# Altium project CANOPi_BaseBoard.PrjPcb (part 2 of 3)

## Sheet CANOPi_Baseboard_PWR.SchDoc
size A3; DocumentNumber: 1; SheetNumber: 1; SheetTotal: 5; CopyrightYear: 2021
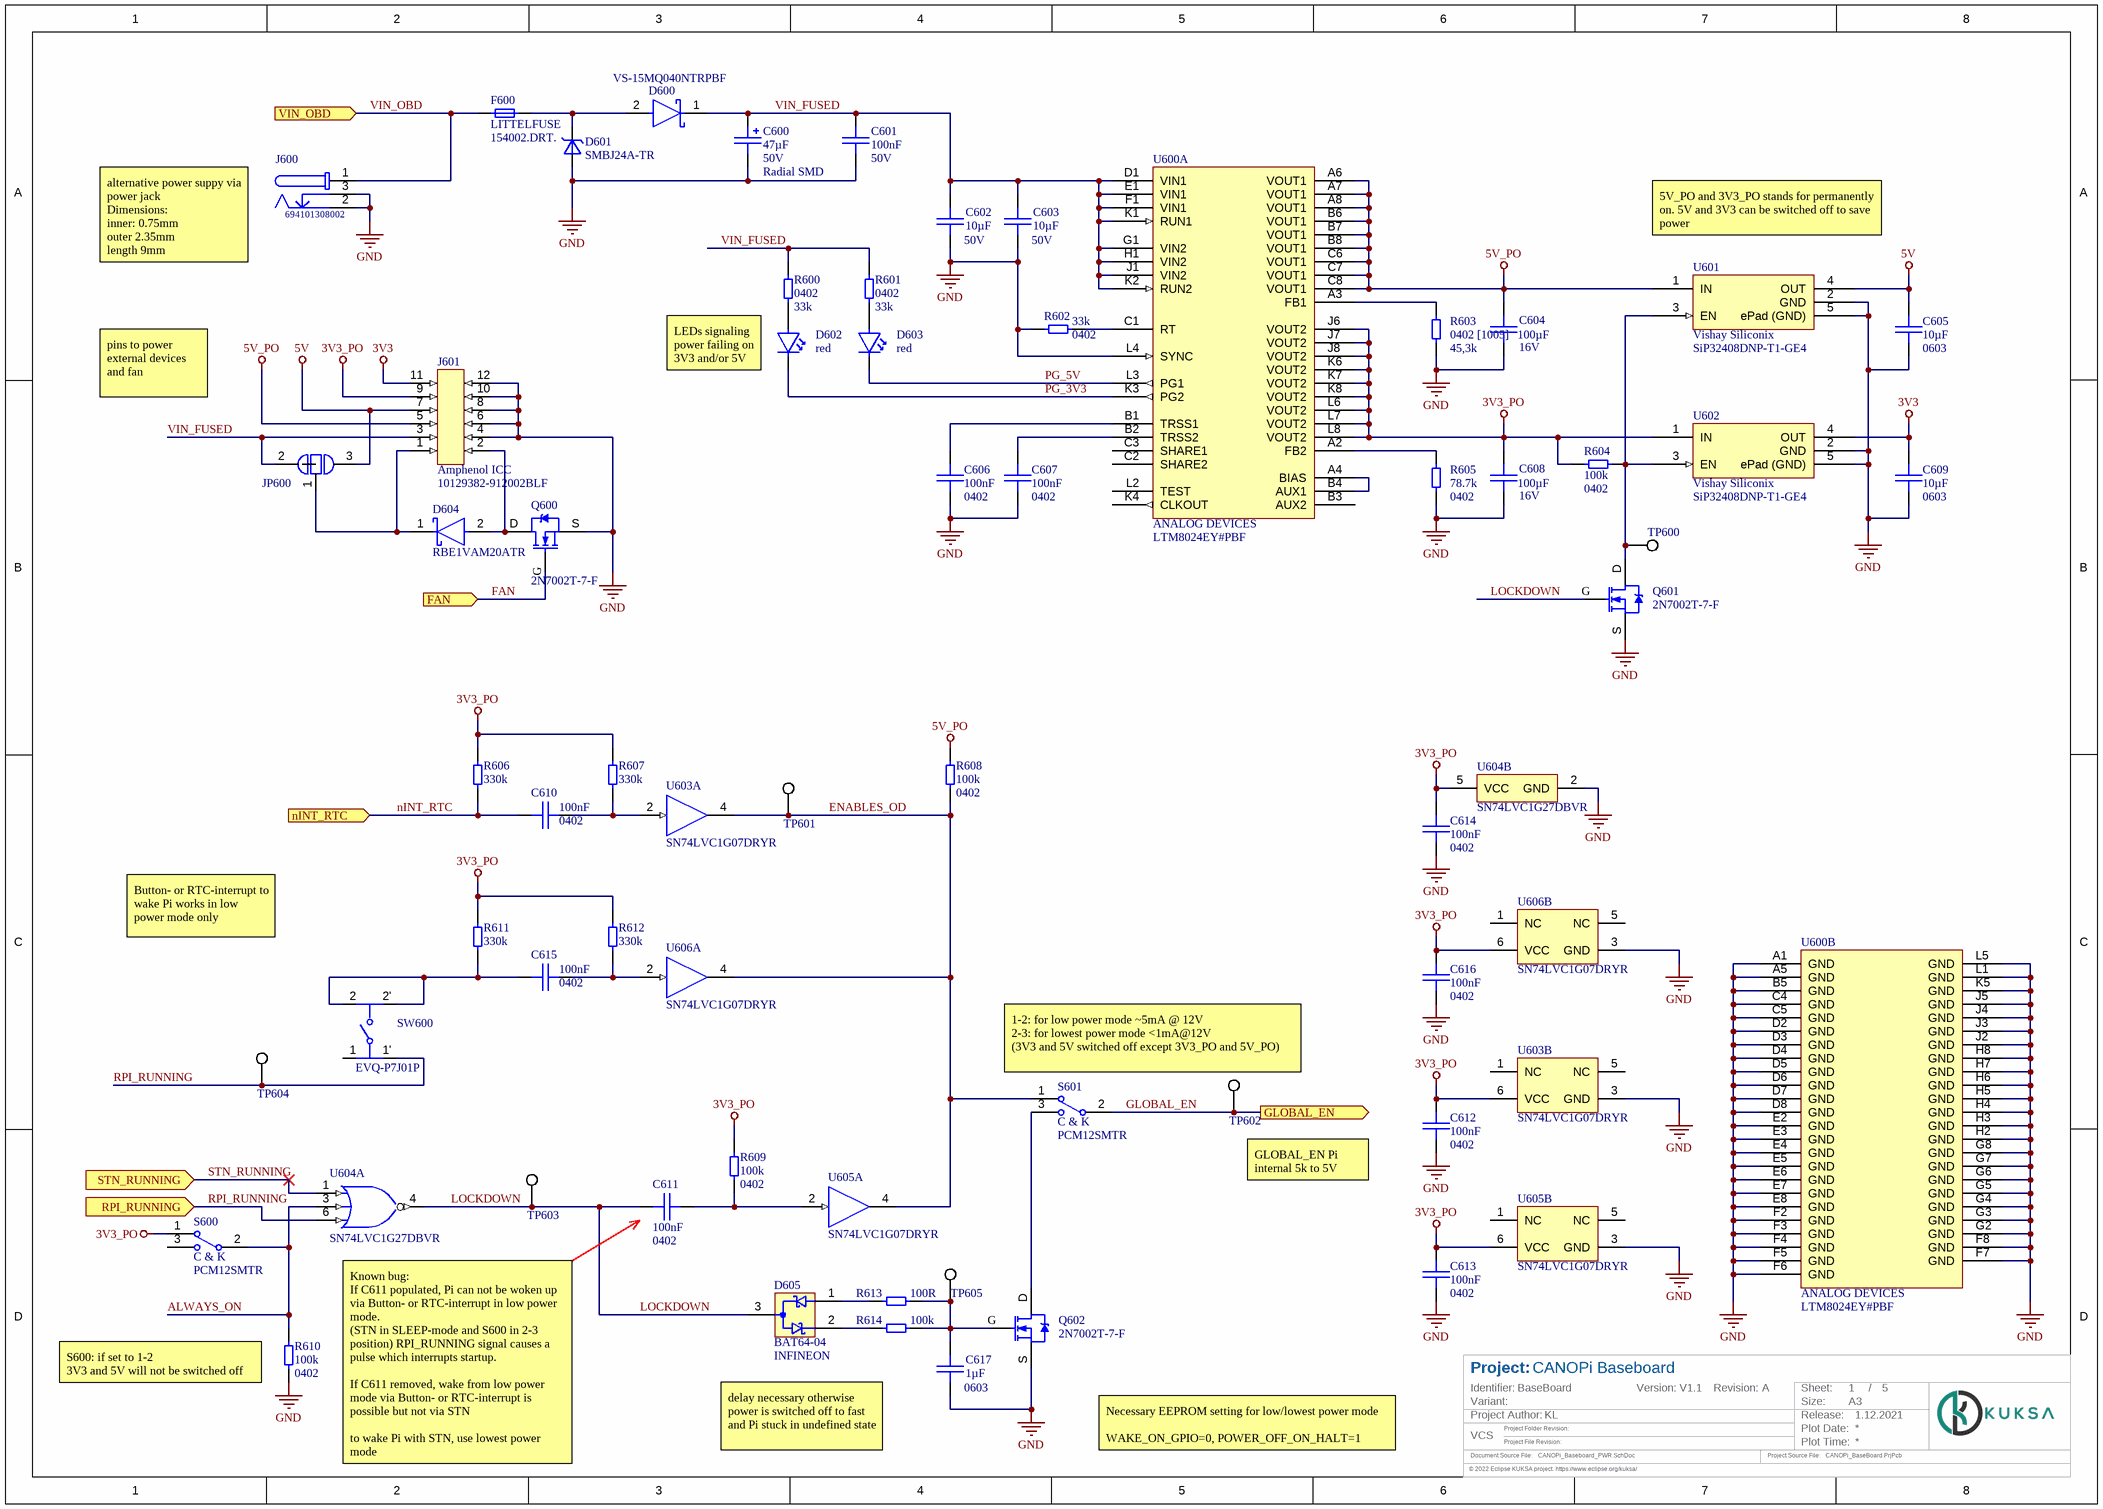
[diagram p2: CANOPi_Baseboard_PWR.SchDoc]

### Parts
C600  Capacitance: 47µF  Voltage Rating: 50V  Case: Radial SMD  [WCAP-ASLI_6.3x7.7]  (hidden comment: CAP2625 47u -20% +20% 50V)
C601  Capacitance: 100nF  Voltage Rating: 50V  [CAP 0603 [1608 Metric] X080 N]  (hidden comment: CAP 0603 100n -10% +10% 50V X7R)
C602  Capacitance: 10µF  Voltage Rating: 50V  [CAP 1206 [3216 Metric] X160 N]  (hidden comment: CAP 1206 10u -10% +10% 50V X5R)
C603  Capacitance: 10µF  Voltage Rating: 50V  [CAP 1206 [3216 Metric] X160 N]  (hidden comment: CAP 1206 10u -10% +10% 50V X5R)
C604  Voltage Rating: 16V  Capacitance: 100µF  [CAP 1210 [3225 Metric] X250 N]  (hidden comment: CAP 1210 100µF +/-20% 16V X5R)
C605  Capacitance: 10µF  Case: 0603  [CAP 0603 [1608 Metric] X080 N]  (hidden comment: CAP 0603 10µF -20% +20% 6.3V X5R)
C606  Capacitance: 100nF  Case: 0402  [CAP 0402 [1005 Metric] X050 N]  (hidden comment: CAP 0402 100n -10% +10% 6.3V X7R)
C607  Capacitance: 100nF  Case: 0402  [CAP 0402 [1005 Metric] X050 N]  (hidden comment: CAP 0402 100n -10% +10% 6.3V X7R)
C608  Voltage Rating: 16V  Capacitance: 100µF  [CAP 1210 [3225 Metric] X250 N]  (hidden comment: CAP 1210 100µF +/-20% 16V X5R)
C609  Capacitance: 10µF  Case: 0603  [CAP 0603 [1608 Metric] X080 N]  (hidden comment: CAP 0603 10µF -20% +20% 6.3V X5R)
C610  Capacitance: 100nF  Case: 0402  [CAP 0402 [1005 Metric] X050 N]  (hidden comment: CAP 0402 100n -10% +10% 6.3V X7R)
C611  Capacitance: 100nF  Case: 0402  [CAP 0402 [1005 Metric] X050 N]  (hidden comment: CAP 0402 100n -10% +10% 6.3V X7R)
C612  Capacitance: 100nF  Case: 0402  [CAP 0402 [1005 Metric] X050 N]  (hidden comment: CAP 0402 100n -10% +10% 6.3V X7R)
C613  Capacitance: 100nF  Case: 0402  [CAP 0402 [1005 Metric] X050 N]  (hidden comment: CAP 0402 100n -10% +10% 6.3V X7R)
C614  Capacitance: 100nF  Case: 0402  [CAP 0402 [1005 Metric] X050 N]  (hidden comment: CAP 0402 100n -10% +10% 6.3V X7R)
C615  Capacitance: 100nF  Case: 0402  [CAP 0402 [1005 Metric] X050 N]  (hidden comment: CAP 0402 100n -10% +10% 6.3V X7R)
C616  Capacitance: 100nF  Case: 0402  [CAP 0402 [1005 Metric] X050 N]  (hidden comment: CAP 0402 100n -10% +10% 6.3V X7R)
C617  Capacitance: 1µF  Case: 0603  [CAP 0603 [1608 Metric] X080 N]  (hidden comment: CAP 0603 1u -10% +10% 10V X7R)
D600  VS-15MQ040NTRPBF  [FP-95400-MFG]
D601  Manufacturer Part Number: SMBJ24A-TR  [DO-214AA (SMB) DIOC5436X26N]  (hidden comment: STMICROELECTRONICS - SMBJ24A-TR)
D602  Colour LED1: red  [WUERTH ELEKTRONIK - WL-SMSW]  (hidden comment: WUERTH ELEKTRONIK - 155124RS73200)
D603  Colour LED1: red  [WUERTH ELEKTRONIK - WL-SMSW]  (hidden comment: WUERTH ELEKTRONIK - 155124RS73200)
D604  RBE1VAM20ATR  [FP-TUMD2M-MFG]
D605  Manufacturer Part Number: BAT64-04  Manufacturer: INFINEON  [INFINEON - BAT64-04]  (hidden comment: INFINEON - BAT64-04)
F600  Manufacturer: LITTELFUSE  Manufacturer Part Number: 154002.DRT.  [LITTELFUSE - 154 OMNI-BLOK]  (hidden comment: LITTELFUSE - 154002.DRT.)
J600  694101308002  [694101308002]
J601  Manufacturer: Amphenol ICC  Manufacturer Part Number: 10129382-912002BLF  [AMPHENOL - 10129382-Footprint-1]  (hidden comment: AMPHENOL - 10129382)
JP600  Solder Jumper Triple 0402 with Assembly between 1 and 2  [Solder Jumper Triple 0402 with Assembly between 1 and 2]  (value not drawn)
Q600  Manufacturer Part Number: 2N7002T-7-F  [DIODES INCORPORATED - SOT523]  (hidden comment: DIODES INCORPORATED - 2N7002T)
Q601  Manufacturer Part Number: 2N7002T-7-F  [DIODES INCORPORATED - SOT523]  (hidden comment: DIODES INCORPORATED - 2N7002T)
Q602  Manufacturer Part Number: 2N7002T-7-F  [DIODES INCORPORATED - SOT523]  (hidden comment: DIODES INCORPORATED - 2N7002T)
R600  Case: 0402  Resistance: 33k  [RES 0402 [1005 Metric]_N]  (hidden comment: RES 0402 33K 1% 0W0625)
R601  Case: 0402  Resistance: 33k  [RES 0402 [1005 Metric]_N]  (hidden comment: RES 0402 33K 1% 0W0625)
R602  Case: 0402  Resistance: 33k  [RES 0402 [1005 Metric]_N]  (hidden comment: RES 0402 33K 1% 0W0625)
R603  Case: 0402 [1005]  Resistance: 45,3k  [RES 0402 [1005 Metric]_N]  (hidden comment: RES 0402 45K3 1% 0W0625)
R604  Resistance: 100k  Case: 0402  [RES 0402 [1005 Metric]_N]  (hidden comment: RES 0402 100K 1% 0W0625)
R605  Case: 0402  Resistance: 78.7k  [RES 0402 [1005 Metric]_N]  (hidden comment: RES 0402 78K7 1% 0W0625)
R606  Resistance: 330k  [RES 0402 [1005 Metric]_N]  (hidden comment: RES 0402 330K 1% 0W0625)
R607  Resistance: 330k  [RES 0402 [1005 Metric]_N]  (hidden comment: RES 0402 330K 1% 0W0625)
R608  Resistance: 100k  Case: 0402  [RES 0402 [1005 Metric]_N]  (hidden comment: RES 0402 100K 1% 0W0625)
R609  Resistance: 100k  Case: 0402  [RES 0402 [1005 Metric]_N]  (hidden comment: RES 0402 100K 1% 0W0625)
R610  Resistance: 100k  Case: 0402  [RES 0402 [1005 Metric]_N]  (hidden comment: RES 0402 100K 1% 0W0625)
R611  Resistance: 330k  [RES 0402 [1005 Metric]_N]  (hidden comment: RES 0402 330K 1% 0W0625)
R612  Resistance: 330k  [RES 0402 [1005 Metric]_N]  (hidden comment: RES 0402 330K 1% 0W0625)
R613  Resistance: 100R  [RES 0402 [1005 Metric]_N]  (hidden comment: RES 0402 100R 1% 63mW)
R614  Resistance: 100k  [RES 0402 [1005 Metric]_N]  (hidden comment: RES 0402 100K 1% 0W0625)
S600  Manufacturer: C & K  [PCM12SMTR]  (hidden comment: C & K - PCM12SMTR)
S601  Manufacturer: C & K  [PCM12SMTR]  (hidden comment: C & K - PCM12SMTR)
SW600  EVQ-P7J01P  [FP-EVQ-P7J01P-MFG]
TP600  Testpad, 0.8mm x 0.8mm, round  [Testpad, 0.8mm x 0.8mm, round]  (value not drawn)  (no BOM)
TP601  Testpad, 0.8mm x 0.8mm, round  [Testpad, 0.8mm x 0.8mm, round]  (value not drawn)  (no BOM)
TP602  Testpad, 0.8mm x 0.8mm, round  [Testpad, 0.8mm x 0.8mm, round]  (value not drawn)  (no BOM)
TP603  Testpad, 0.8mm x 0.8mm, round  [Testpad, 0.8mm x 0.8mm, round]  (value not drawn)  (no BOM)
TP604  Testpad, 0.8mm x 0.8mm, round  [Testpad, 0.8mm x 0.8mm, round]  (value not drawn)  (no BOM)
TP605  Testpad, 0.8mm x 0.8mm, round  [Testpad, 0.8mm x 0.8mm, round]  (value not drawn)  (no BOM)
U600  Manufacturer: ANALOG DEVICES  Manufacturer Part Number: LTM8024EY#PBF  [ANALOG DEVICES - LTM8024]  (hidden comment: ANALOG DEVICES - LTM8024EY#PBF)  (parts A,B of 2)
U601  Manufacturer: Vishay Siliconix  Manufacturer Part Number: SiP32408DNP-T1-GE4  [DFN130P160X60-4N]  (hidden comment: VISHAY - SIP32408)
U602  Manufacturer: Vishay Siliconix  Manufacturer Part Number: SiP32408DNP-T1-GE4  [DFN130P160X60-4N]  (hidden comment: VISHAY - SIP32408)
U603  SN74LVC1G07DRYR  [DRY0006A_V]  (parts A,B of 2)
U604  SN74LVC1G27DBVR  [DBV0006A_N]  (parts A,B of 2)
U605  SN74LVC1G07DRYR  [DRY0006A_V]  (parts A,B of 2)
U606  SN74LVC1G07DRYR  [DRY0006A_V]  (parts A,B of 2)

### Ports
FAN (in), GLOBAL_EN (out), nINT_RTC (in), RPI_RUNNING (in), STN_RUNNING (in), VIN_OBD (in)

### Nets
3V3: C609.1 J601.11 U602.4(OUT)
3V3_PO: C608.2 C612.1 C613.1 C614.1 C616.1 J601.9 R604.2 R606.2 R607.2 R609.2 R611.2 R612.2 S600.1 U600.J6(VOUT2) U600.J7(VOUT2) U600.J8(VOUT2) U600.K6(VOUT2) U600.K7(VOUT2) U600.K8(VOUT2) U600.L6(VOUT2) U600.L7(VOUT2) U600.L8(VOUT2) U602.1(IN) U603.6(VCC) U604.5(VCC) U605.6(VCC) U606.6(VCC)
5V: C605.1 J601.7 JP600.3 U601.4(OUT)
5V_PO: C604.2 J601.5 R608.2 U600.A6(VOUT1) U600.A7(VOUT1) U600.A8(VOUT1) U600.B6(VOUT1) U600.B7(VOUT1) U600.B8(VOUT1) U600.C6(VOUT1) U600.C7(VOUT1) U600.C8(VOUT1) U601.1(IN)
GND: C600.2 C601.1 C602.1 C603.1 C604.1 C605.2 C606.2 C607.2 C608.1 C609.2 C612.2 C613.2 C614.2 C616.2 C617.2 D601.A J600.2 J600.3 J601.4 J601.6 J601.8 J601.10 J601.12 Q600.S Q601.S Q602.S R602.2 R603.1 R605.1 R610.1 U600.A1(GND) U600.A5(GND) U600.B5(GND) U600.C4(GND) U600.C5(GND) U600.D2(GND) U600.D3(GND) U600.D4(GND) U600.D5(GND) U600.D6(GND) U600.D7(GND) U600.D8(GND) U600.E2(GND) U600.E3(GND) U600.E4(GND) U600.E5(GND) U600.E6(GND) U600.E7(GND) U600.E8(GND) U600.F2(GND) U600.F3(GND) U600.F4(GND) U600.F5(GND) U600.F6(GND) U600.F7(GND) U600.F8(GND) U600.G2(GND) U600.G3(GND) U600.G4(GND) U600.G5(GND) U600.G6(GND) U600.G7(GND) U600.G8(GND) U600.H2(GND) U600.H3(GND) U600.H4(GND) U600.H5(GND) U600.H6(GND) U600.H7(GND) U600.H8(GND) U600.J2(GND) U600.J3(GND) U600.J4(GND) U600.J5(GND) U600.K5(GND) U600.L1(GND) U600.L4(SYNC) U600.L5(GND) U601.2(GND) U601.5(ePad_(GND)) U602.2(GND) U602.5(ePad_(GND)) U603.3(GND) U604.2(GND) U605.3(GND) U606.3(GND)
ALWAYS_ON: R610.2 S600.2 U604.3(B)
ENABLES_OD: R608.1 S601.1 TP601.1 U603.4(Y) U605.4(Y) U606.4(Y)
FAN: Q600.G ; port FAN
GLOBAL_EN: S601.2 TP602.1 ; port GLOBAL_EN
LOCKDOWN: C611.1 D605.3 Q601.G TP603.1 U604.4(Y)
nINT_RTC: C610.2 R606.1 ; port nINT_RTC
PG_3V3: D602.C U600.K3(PG2)
PG_5V: D603.C U600.L3(PG1)
RPI_RUNNING: SW600.1' TP604.1 U604.6(C) ; port RPI_RUNNING
STN_RUNNING: U604.1(A) ; port STN_RUNNING
VIN_FUSED: C600.1 C601.2 C602.2 C603.2 D600.1(C) J601.3 JP600.2 R600.1 R601.1 U600.D1(VIN1) U600.E1(VIN1) U600.F1(VIN1) U600.G1(VIN2) U600.H1(VIN2) U600.J1(VIN2) U600.K1(RUN1) U600.K2(RUN2)
VIN_OBD: F600.1 J600.1 ; port VIN_OBD
NetC606_1: C606.1 U600.B1(TRSS1)
NetC607_1: C607.1 U600.B2(TRSS2)
NetC610_1: C610.1 R607.1 U603.2(A)
NetC611_2: C611.2 R609.1 U605.2(A)
NetC615_1: C615.1 R612.1 U606.2(A)
NetC615_2: C615.2 R611.1 SW600.2 SW600.2'
NetC617_1: C617.1 Q602.G R613.1 R614.1 TP605.1
NetD600_2: D600.2(A) D601.C F600.2
NetD602_A: D602.A R600.2
NetD603_A: D603.A R601.2
NetD604_1: D604.1(C) J601.1 JP600.1
NetD604_2: D604.2(A) J601.2 Q600.D
NetD605_1: D605.1 R613.2
NetD605_2: D605.2 R614.2
NetQ601_D: Q601.D R604.1 TP600.1 U601.3(EN) U602.3(EN)
NetQ602_D: Q602.D S601.3
NetR602_1: R602.1 U600.C1(RT)
NetR603_2: R603.2 U600.A3(FB1)
NetR605_2: R605.2 U600.A2(FB2)
NetU600_A4: U600.A4(BIAS) U600.B4(AUX1)

Not connected (* = marked no-connect by the designer): S600 3; SW600 1; U600 B3(AUX2) C2(SHARE2) C3(SHARE1) K4(CLKOUT) L2(TEST); U603 1(NC) 5(NC); U605 1(NC) 5(NC); U606 1(NC) 5(NC)

### Notes on the sheet
- 5V_PO and 3V3_PO stands for permanently on. 5V and 3V3 can be switched off to save power
- alternative power suppy via power jack
  Dimensions:
  inner: 0.75mm
  outer 2.35mm
  length 9mm
- LEDs signaling
  power failing on 3V3 and/or 5V rail
- pins to power external devices and fan
- Button- or RTC-interrupt to wake Pi works in low power mode only
- 1-2: for low power mode ~5mA @ 12V
  2-3: for lowest power mode <1mA@12V
  (3V3 and 5V switched off except 3V3_PO and 5V_PO)
- GLOBAL_EN Pi internal 5k to 5V
- (near R610) S600: if set to 1-2
  3V3 and 5V will not be switched off
- Project:
- Identifier:
- Version:
- Revision:
- Sheet:
- /
- Known bug:
  If C611 populated, Pi can not be woken up via Button- or RTC-interrupt in low power mode.
  (STN in SLEEP-mode and S600 in 2-3 position) RPI_RUNNING signal causes a pulse which interrupts startup.
  If C611 removed, wake from low power mode via Button- or RTC-interrupt is possible but not via STN
  to wake Pi with STN, use lowest power mode
- delay necessary otherwise power is switched off to fast and Pi stuck in undefined state
- Necessary EEPROM setting for low/lowest power mode
  WAKE_ON_GPIO=0, POWER_OFF_ON_HALT=1
- VCS
- Variant:
- Document Source File:
- Project Author:
- Project Folder Revision:
- Project File Revision:
- Project Source File:
- Plot Date:
- Size:
- Plot Time:
- Release:
- A3
- © 2022 Eclipse KUKSA project. https://www.eclipse.org/kuksa/
- Drawn by:
- © Robert Bosch GmbH         . All rights reserved, also regarding any disposal, exploitation, reproduction, editing, distribution, as well as in the event of applications for industrial property rights.

### Library data of the parts
C600 = CMP-04572-5: WCAP-ASLL Aluminium Electrolytic Capacitor (SMD Type): -55°C to 105°, Reflow Soldering, Low Impedance; Manufacturer: WUERTH ELEKTRONIK; Manufacturer Part Number: 865060645008; Assembly: yes; Capacitance Tolerance pos: 20%; Impedance: 0,68; Ripple Current max: 185mA; Leak Current: 23,5µA; Ripple Frequency: 100kHz; Value: 47µF; Capacitance Tolerance neg: -20%; ComponentLink1Description: Datasheet; ComponentLink1URL: http://katalog.we-online.de/pbs/datasheet/865060645008.pdf; Mounting Type: SMT; Operating Temperature max: 105°C; Operating Temperature min: -55°C
C601 = CMP-11004-1: SMD/SMT 0603 50V -10% +10% X7R - Multilayer Ceramic Capacitors MLCC; Manufacturer Part Number: 885012206095; Manufacturer: WUERTH ELEKTRONIK; Value: 100nF; Capacitance Tolerance pos: 10%; Assembly: yes; Operating Temperature max: 125°C; Mounting Type: SMT; Operating Temperature min: -55°C; Dielectric Type: X7R; Capacitance Tolerance neg: -10%; IPC Footprint Naming: CAPC1608X080; ComponentLink1Description: Datasheet; ComponentLink1URL: https://www.we-online.de/katalog/datasheet/885012206095.pdf; Case: 0603 [1608]
C602 C603 = CMP-05401-6: Multilayer Ceramic Capacitors MLCC - SMD/SMT 10uF 50Volts 10%; Manufacturer: MURATA; Manufacturer Part Number: GRT31CR61H106KE01; Assembly: yes; Value: 10µF; IPC Footprint Naming: CAPC3216X160; Mounting Type: SMT; Capacitance Tolerance neg: -10%; Operating Temperature max: 85°C; Operating Temperature min: -55°C; ComponentLink1Description: Datasheet; Case: 1206 [3216]; Dielectric Type: X5R; Capacitance Tolerance pos: 10%; ComponentLink1URL: https://psearch.en.murata.com/capacitor/product/GRT31CR61H106KE01%23.html
C604 C608 = CMP-10010-2: 100µF ±20% 16V Ceramic Capacitor X5R 1210 (3225 Metric); Manufacturer Part Number: EMK325ABJ107MM-T; Manufacturer: TAIYO YUDEN; Assembly: yes; Capacitance Tolerance neg: -20%; Dielectric Type: X5R; Operating Temperature min: -55°C; Capacitance Tolerance pos: 20%; ComponentLink1Description: Manufacturer Link; Mounting Type: SMT; Operating Temperature max: 85°C; Case: 1210 [3225]; ComponentLink1URL: https://www.yuden.co.jp/productdata/catalog/mlcc06_e.pdf; Value: 100µF
C605 C609 = CMP-06061-3: SMT 10µF ±20% 6,3 V Keramikkondensatoren X5R; Manufacturer Part Number: GRM188R60J106ME84; Manufacturer: MURATA; Voltage Rating: 6,3V; Assembly: yes; Operating Temperature max: 85°C; IPC Footprint Naming: CAPC1608X080; Mounting Type: SMT; Dielectric Type: X5R; Value: 10µF; ComponentLink1Description: Datasheet; Capacitance Tolerance pos: 20%; ComponentLink1URL: https://search.murata.co.jp/Ceramy/image/img/A01X/G101/ENG/GRM188R60J106ME84-01.pdf; Operating Temperature min: -55°C; Capacitance Tolerance neg: -20%
C606 C607 C610-C616 = CMP-04212-4: SMD/SMT 0402 6.3V -10% +10% X7R - Multilayer Ceramic Capacitors MLCC; Manufacturer: MURATA; Manufacturer Part Number: GRM155R70J104KA01#; Capacitance Tolerance pos: 10%; Value: 100nF; Assembly: yes; Operating Temperature min: -55°C; Voltage Rating: 6.3V; Operating Temperature max: 125°C; ComponentLink1URL: http://psearch.en.murata.com/capacitor/lineup/grm/; IPC Footprint Naming: CAPC1005X050; Capacitance Tolerance neg: -10%; ComponentLink1Description: Datasheet; Dielectric Type: X7R; Mounting Type: SMT
C617 = CMP-02997-5: SMD/SMT 0603 10V -10% +10% X7R - Multilayer Ceramic Capacitors MLCC; Manufacturer Part Number: GRM188R71A105KA61#; Manufacturer: MURATA; Capacitance Tolerance pos: 10%; Value: 1µF; Assembly: yes; IPC Footprint Naming: CAPC1608X080; Voltage Rating: 10V; Mounting Type: SMT; Operating Temperature max: 125°C; Operating Temperature min: -55°C; ComponentLink1Description: Datasheet; Capacitance Tolerance neg: -10%; ComponentLink1URL: http://psearch.en.murata.com/capacitor/lineup/grm/; Dielectric Type: X7R
D600 = CMP-02539-000025-1: DIODE SCHOTTKY 40V 1.5A SMA; Manufacturer: Vishay; Standoff Height: 0mm; Capacitance: 134pF; Peak Reverse Current: 0.5mA; Max Junction Temp: +150°C; Value: 134pF; Max Surge Forward Current: 140A; RoHS: TRUE; Lead Free: Yes; Octopart: https://octopart.com/vs-15mq040ntrpbf-vishay-44340959; Max Repetitive Reverse Voltage: 40V; Device Class L1: Discrete Semiconductors; ComponentLink2URL: http://www.vishay.com/docs/94141/vs-15mq040ntrpbf.pdf; Reverse Voltage: 40V; ComponentLink2Description: Datasheet; Forward Current: 1.5A; Temperature: -40°C to +150°C; Digikey Description: DIODE SCHOTTKY 40V 1.5A SMA; Height: 2.29mm; Category: Diode; Footprint Url: http://www.vishay.com/docs/95400/sma.pdf; Device Class L2: Diodes; Device Class L3: Schottky Diodes; Mouser Description: Schottky Diodes & Rectifiers 2.1 Amp 40 Volt; Manufacturer Part Number: VS-15MQ040NTRPBF; Automotive: No; Package: 95400; Temperature Range Low: -40°C; Temperature Range High: +150°C
D601 = CMP-06267-5: TVS DIODE unidirectional 24V DO214AA SMB; Breakdown Voltage: 28.1V; ESD Voltage Contact: 8kV; Assembly: yes; No. of Channels: 1; ESD Voltage Air: 15kV; ComponentLink1Description: Datasheet; Operating Temperature max: 150°C; Channel Type: unidirectional; Manufacturer: STMICROELECTRONICS; ComponentLink1URL: https://www.st.com/resource/en/datasheet/smbj.pdf; Operating Temperature min: -55°C; Mounting Type: SMT; Case: DO-214AA (SMB); Reverse Standoff Voltage: 24V
D602 D603 = CMP-11201-1: LED, RED, Right Angle SMD 3.2*1.0mm WL-SMSW SMT Mono-color Side view Waterclear; View Angle: 120°; Wavelength LED1: 470nm; Reverse Voltage LED1: 5V; Forward Voltage LED1: 2V; Luminous Intensity LED1: 150mcd; Forward Current LED1: 25mA; Assembly: yes; Case: 1305; Operating Temperature max: 85°C; ComponentLink1Description: Datahseet; Manufacturer: WUERTH ELEKTRONIK; Operating Temperature min: -40°C; ComponentLink1URL: https://katalog.we-online.de/led/datasheet/155124BS73200.pdf; Mounting Type: SMT; Manufacturer Part Number: 155124RS73200
D604 = CMP-08971-000009-1: DIODE SCHOTTKY 20V 1A TUMD2M; Manufacturer: Rohm; Max Repetitive Reverse Voltage: 30V; Peak Reverse Current: 200uA; Max Surge Forward Current: 3A; Max Junction Temp: +125°C; Category: Diode; Manufacturer Part Number: RBE1VAM20ATR; Automotive: No; Height: 0.8mm; ComponentLink2Description: Datasheet; Device Class L1: Discrete Semiconductors; Device Class L2: Diodes; Digikey Description: DIODE SCHOTTKY 20V 1A TUMD2M; Octopart: https://octopart.com/rbe1vam20atr-rohm-50418626; RoHS: TRUE; Lead Free: Yes; Package: TUMD2M; Device Class L3: Schottky Diodes; ComponentLink2URL: https://www.rohm.com/datasheet/RBE1VAM20A/rbe1vam20atr-e; Reverse Voltage: 20V; Forward Current: 1A
D605 = CMP-07202-6: Dual Silicon Schottky Diodes in series configuration; Reverse Voltage: 40V; Forward Voltage: 750mV; Forward Current: 250mA; Assembly: yes; Case: SOT-23; ComponentLink1URL: https://www.infineon.com/dgdl/Infineon-BAT64SERIES-DataSheet-v01_00-EN.pdf?fileId=5546d4626d66c2b1016d73f85ab420ed; ComponentLink1Description: Datasheet; Mounting Type: SMT; Operating Temperature max: 150°C; Operating Temperature min: -55°C
F600 = CMP-00370-4: Sicherung 2A - NANO2 > 154 OMNI-BLOK - Fuse and Holder Combination; Blow Characteristic: T; Assembly: yes; Voltage Rating AC: 125V; Case: 154 Series; ComponentLink1Description: Manufacturer Link; ComponentLink1URL: http://www.littelfuse.de/products/fuse-blocks-fuseholders-and-fuse-accessories/fuse-blocks/154.aspx; Fuse Current: 2A; Mounting Type: SMT; Operating Temperature max: 125°C; Operating Temperature min: -55°C; Voltage Rating DC: 125V
J600 = CMP-1502-00182-1: DC Power Jack Connector Low Profile WR-DC, Male, Right Angled, THT, 2 A, 12 V; Manufacturer: Wurth Elektronik; Opening Diameter: 2.8mm; Rated Current: 2A; Plug Inner Diameter: 0.75mm; Working Voltage: 12V; Plug Outer Diameter: 2.35mm; Part Number: 694101308002; Packaging: Bag; Mounting Technology: THT; Orientation: RightAngled; Package Reference: 694101308002; Datasheet URL: http://katalog.we-online.de/em/datasheet/694101308002.pdf; Publisher: WurthElektronik; Manufacturer URL: http://www.we-online.de; Gender: Male; Operating Temperature: -40to85degC
J601 = CMP-11266-2: Connector Header Through Hole, Right Angle 12 position 0.100" (2.54mm); Current Rating: 3A; Gender: male; Assembly: yes; Pitch Spacing: 2,54mm; Voltage Rating: 110V; Operating Temperature max: 105°C; Mounting Type: THT; Number of Rows: 2; ComponentLink1Description: Manufacturer Link; Number of Pins: 12; ComponentLink1URL: https://www.amphenol-icc.com/econostik-10129382910004blf.html; Operating Temperature min: -55°C
JP600 = CMP-04522-6: Manufacturer: YAGEO; Manufacturer Part Number: RC0402JR-070RL; Operating Temperature max: 0°C; Mounting Type: SMT; Assembly: between 1 and 2; ComponentLink1Description: Datasheet; Operating Temperature min: 0°C; Case: 0402 Triple
Q600-Q602 = CMP-11252-1: N-CHANNEL ENHANCEMENT MODE FIELD EFFECT TRANSISTOR; Assembly: yes; Drain Current DC: 150mA; Drain Source On Resistance: 2; Drain Source Voltage: 60V; Gate Source Voltage: 20V; Threshold Voltage: 2V; Mounting Type: SMT; Operating Temperature min: -55°C; ComponentLink1Description: Manufacturer Link; Transistor Polarity: N-Channel; Manufacturer: DIODES INCORPORATED; Operating Temperature max: 150°C; ComponentLink1URL: https://www.diodes.com/assets/Datasheets/ds30301.pdf; IPC Footprint Naming: SOT523; Case: SOT523
R600-R602 = CMP-01017-5: RC0402 series chip resistor with lead-free terminations made by thick film process; Manufacturer: YAGEO; Manufacturer Part Number: RC0402FR-0733KL; Assembly: yes; Power Rating: 62.5mW; Voltage Rating: 50V; Temperature Coefficient: ±100ppm/K; Current Rating: 1A; Operating Temperature max: 155°C; ComponentLink1URL: http://www.yageo.com/documents/recent/PYu-RC0402_51_RoHS_L_6.pdf; Resistor Element Type: Thick Film; Value: 33k; Mounting Type: SMT; ComponentLink1Description: Datasheet; IPC Footprint Naming: RESC1005X04; Operating Temperature min: -55°C; Resistance Tolerance: 1%
R603 = CMP-01034-6: RC0402 series chip resistor with lead-free terminations made by thick film process; Manufacturer Part Number: RC0402FR-0745K3L; Manufacturer: YAGEO; Voltage Rating: 50V; Current Rating: 1A; Value: 45,3k; Temperature Coefficient: ±100ppm/K; Assembly: yes; Power Rating: 62,5mW; IPC Footprint Naming: RESC1005X04; Operating Temperature max: 155°C; Resistance Tolerance: 1%; Mounting Type: SMT; Operating Temperature min: -55°C; ComponentLink1URL: http://www.yageo.com/documents/recent/PYu-RC0402_51_RoHS_L_6.pdf; ComponentLink1Description: Datasheet; Resistor Element Type: Thick Film
R604 R608-R610 R614 = CMP-01074-5: RC0402 series chip resistor with lead-free terminations made by thick film process; Manufacturer Part Number: RC0402FR-07100KL; Manufacturer: YAGEO; Temperature Coefficient: ±100ppm/K; Current Rating: 1A; Assembly: yes; Power Rating: 62.5mW; Voltage Rating: 50V; Mounting Type: SMT; ComponentLink1URL: http://www.yageo.com/documents/recent/PYu-RC0402_51_RoHS_L_6.pdf; Operating Temperature max: 155°C; Operating Temperature min: -55°C; Resistor Element Type: Thick Film; IPC Footprint Naming: RESC1005X04; ComponentLink1Description: Datasheet; Value: 100k; Resistance Tolerance: 1%
  R614: Case: 0402
R605 = CMP-01062-6: RC0402 series chip resistor with lead-free terminations made by thick film process; Manufacturer: YAGEO; Manufacturer Part Number: RC0402FR-0778K7L; Power Rating: 62.5mW; Current Rating: 1A; Assembly: yes; Value: 78.7k; Temperature Coefficient: ±100ppm/K; Voltage Rating: 50V; Operating Temperature max: 155°C; IPC Footprint Naming: RESC1005X04; Resistance Tolerance: 1%; ComponentLink1Description: Datasheet; ComponentLink1URL: http://www.yageo.com/documents/recent/PYu-RC0402_51_RoHS_L_6.pdf; Resistor Element Type: Thick Film; Mounting Type: SMT; Operating Temperature min: -55°C
R606 R607 = CMP-01136-6: RC0402 series chip resistor with lead-free terminations made by thick film process; Manufacturer Part Number: RC0402FR-07330KL; Manufacturer: YAGEO; Temperature Coefficient: ±100ppm/K; Current Rating: 1A; Power Rating: 62,5mW; Voltage Rating: 50V; Assembly: yes; Operating Temperature min: -55°C; Value: 330k; Resistance Tolerance: 1%; Case: 0402 [1005]; Resistor Element Type: Thick Film; Mounting Type: SMT; Operating Temperature max: 155°C; IPC Footprint Naming: RESC1005X04; ComponentLink1Description: Datasheet; ComponentLink1URL: http://www.yageo.com/documents/recent/PYu-RC0402_51_RoHS_L_6.pdf
R611 R612 = CMP-01136-6: RC0402 series chip resistor with lead-free terminations made by thick film process; Manufacturer: YAGEO; Manufacturer Part Number: RC0402FR-07330KL; Assembly: yes; Current Rating: 1A; Power Rating: 62,5mW; Temperature Coefficient: ±100ppm/K; Voltage Rating: 50V; Case: 0402 [1005]; ComponentLink1Description: Datasheet; ComponentLink1URL: http://www.yageo.com/documents/recent/PYu-RC0402_51_RoHS_L_6.pdf; IPC Footprint Naming: RESC1005X04; Mounting Type: SMT; Operating Temperature max: 155°C; Operating Temperature min: -55°C; Resistance Tolerance: 1%; Resistor Element Type: Thick Film; Value: 330k
R613 = CMP-06970-3: RC0402 series chip resistor with lead-free terminations made by thick film process; Manufacturer: ROHM; Manufacturer Part Number: MCR01MZPF100; Assembly: yes; Temperature Coefficient: ±100ppm/K; eADM Name: 8905501369; Voltage Rating: 50V; Value: 100; Current Rating: 1A; IPC Footprint Naming: RESC1005X04; Operating Temperature min: -55°C; Resistor Element Type: Thick Film; Case: 0402; Resistance Tolerance: 1%; ComponentLink1URL: https://www.rohm.com/site-search?p_p_id=rohmsitesearch_WAR_rohmcomboportlet&p_p_lifecycle=1&p_p_state=normal&_rohmsitesearch_WAR_rohmcomboportlet_action=siteSearchAction&p_auth=xKaajgv6; ComponentLink1Description: Datasheet; Operating Temperature max: 155°C; Power Rating: 63mW; Mounting Type: SMT
S600 S601 = CMP-00177-8: C & K Schiebeschalter PCM12SMTR 1-polig Ein-Ein, 0,3 A @ 6 V dc - Slide Switches 0.3A SPDT ON-ON; Number of Position: 2; Contact Current Rating: 300mA; Contact Voltage DC: 6V; Switch Type: toggle; Assembly: yes; Operating Temperature max: 85°C; Mounting Type: SMT; ComponentLink1Description: Datasheet; ComponentLink1URL: http://www.ck-components.com/media/1424/pcm.pdf; Operating Temperature min: -20°C; Switch Function: on - on; Case: PCM12SMTR; Contact Form: SPDT; Manufacturer Part Number: PCM12SMTR
SW600 = CMP-05618-000001-1: SWITCH TACTILE SPST-NO 0.05A 12V; Manufacturer: Panasonic; Operating Force: 1.6N; Contact Current Rating: 50mA; Electromechanical Life: 100000Cycles; Contact Resistance: 500mΩ; Height: 1.55mm; Temperature Range Low: -20°C; Device Class L1: Electromechanical; Package: 0; RoHS: TRUE; Category: Switch; ComponentLink2Description: Datasheet; Device Class L2: Switches; Temperature Range High: +70°C; Mount: Surface Mount; Device Class L3: Tactile Switches; Temperature: -20°C to +70°C; Automotive: No; Manufacturer Part Number: EVQ-P7J01P; Mouser Description: Tactile Switches 3.5x2.9mm Right Ang Light Touch Switch; ComponentLink2URL: https://b2b-api.panasonic.eu/file_stream/pids/fileversion/2431; Lead Free: Yes; Octopart: https://octopart.com/evq-p7j01p-panasonic-29917078; Digikey Description: SWITCH TACTILE SPST-NO 0.05A 12V; Voltage Rating Dc: 12V; Throw Configuration: SPST-NO
TP600-TP605 = CMP-00390-13: Assembly: no; Case: 0.8x0.8mm, round
U600 = CMP-11023-1: 40VIN, Dual 3.5A or Single 7A Silent Switcher ¿Module Regulator; Output Voltage max: 8V; Assembly: yes; No. of Outputs: 2; Switching Frequency max: 3MHz; Input Voltage max: 40V; Output Current max: 3,5A; Input Voltage min: 3V; DC/DC Converter Topology: Step-Down Switching (Silent Switcher); Output Voltage min: 800mV; Case: BGA-88; Operating Temperature min: -40°C; ComponentLink1Description: Manufacturer Link; Operating Temperature max: 125°C; ComponentLink1URL: https://www.analog.com/media/en/technical-documentation/data-sheets/LTM8024.pdf; Mounting Type: SMT
U601 U602 = CMP-11074-2: 1.1 V to 5.5 V, Slew Rate Controlled Load Switch; Output Voltage min: 1,1V; Output Current max: 3,5A; Output Voltage max: 5,5V; No. of Outputs: 1; Assembly: yes; ComponentLink1Description: Manufacturer Link; Mounting Type: SMD; ComponentLink1URL: https://www.vishay.com/product?docid=63717; Case: TDFN4; Operating Temperature min: -40°C; Input Voltage min: 1,1V; Input Voltage max: 5,5V; Operating Temperature max: 85°C
U603 U605 U606 = CMP-0859-00833-3: Single Buffer/Driver With Open-Drain Output, DRY0006A, LARGE T&R; Manufacturer: Texas Instruments; Sub-Family: Non-Inverting Buffer/Driver; Output Type: CMOS; Bits(#): 1; Schmitt Trigger: No; Output Drive (IOL/IOH)(Max)(mA): 32/-32; ICC @ Nom Voltage(Max)(mA): 0.01; Technology Family: LVC; Rating: Catalog; VCC(Min)(V): 1.65; tpd @ Nom Voltage(Max)(ns): 8.6,6,4.7,4; VCC(Max)(V): 5.5; F @ Nom Voltage(Max)(Mhz): 150; Logic: True; Input Type: CMOS/TTL; Voltage(Nom)(V): 1.8,2.5,3.3,5; Operating Temperature Range(C): -40 to 125,-40 to 85; DatasheetVersion: SCES296AC; Generic Part Number: SN74LVC1G07; PackageReference: DRY0006A; 3-State Output: No; PartId: 1
U604 = CMP-0859-00214-1: Single 3-Input Positive-NOR Gate, DBV0006A, LARGE T&R; 3-State Output: No; Output Drive (IOL/IOH)(Max)(mA): 32/-32; Input Type: CMOS/TTL; Logic: True; Output Type: CMOS; VCC(Min)(V): 1.65; tpd @ Nom Voltage(Max)(ns): 20.5,7.1,5.4,3.6; Voltage(Nom)(V): 1.8,2.5,3.3,5; VCC(Max)(V): 5.5; F @ Nom Voltage(Max)(Mhz): 150; Technology Family: LVC; Rating: Catalog; Bits(#): 1; ICC @ Nom Voltage(Max)(mA): 0.01; Gate Type: OR; ComponentLink1URL: http://www.ti.com/; PackageReference: DBV0006A; DatasheetVersion: SCES488E; ComponentLink2URL: http://www.ti.com/lit/ds/symlink/sn74lvc1g27.pdf; ComponentLink1Description: Manufacturer URL; Sub-Family: NOR Gate; Schmitt Trigger: No; PartNumber: SN74LVC1G27DBVR; Operating Temperature Range(C): -40 to 125,-40 to 85; ComponentLink2Description: Datasheet; Part Number: SN74LVC1G27; PartId: 1

## Sheet CANOPi_Baseboard_RTC.SchDoc
size A4; DocumentNumber: 5; SheetNumber: 5; SheetTotal: 5; CopyrightYear: 2021
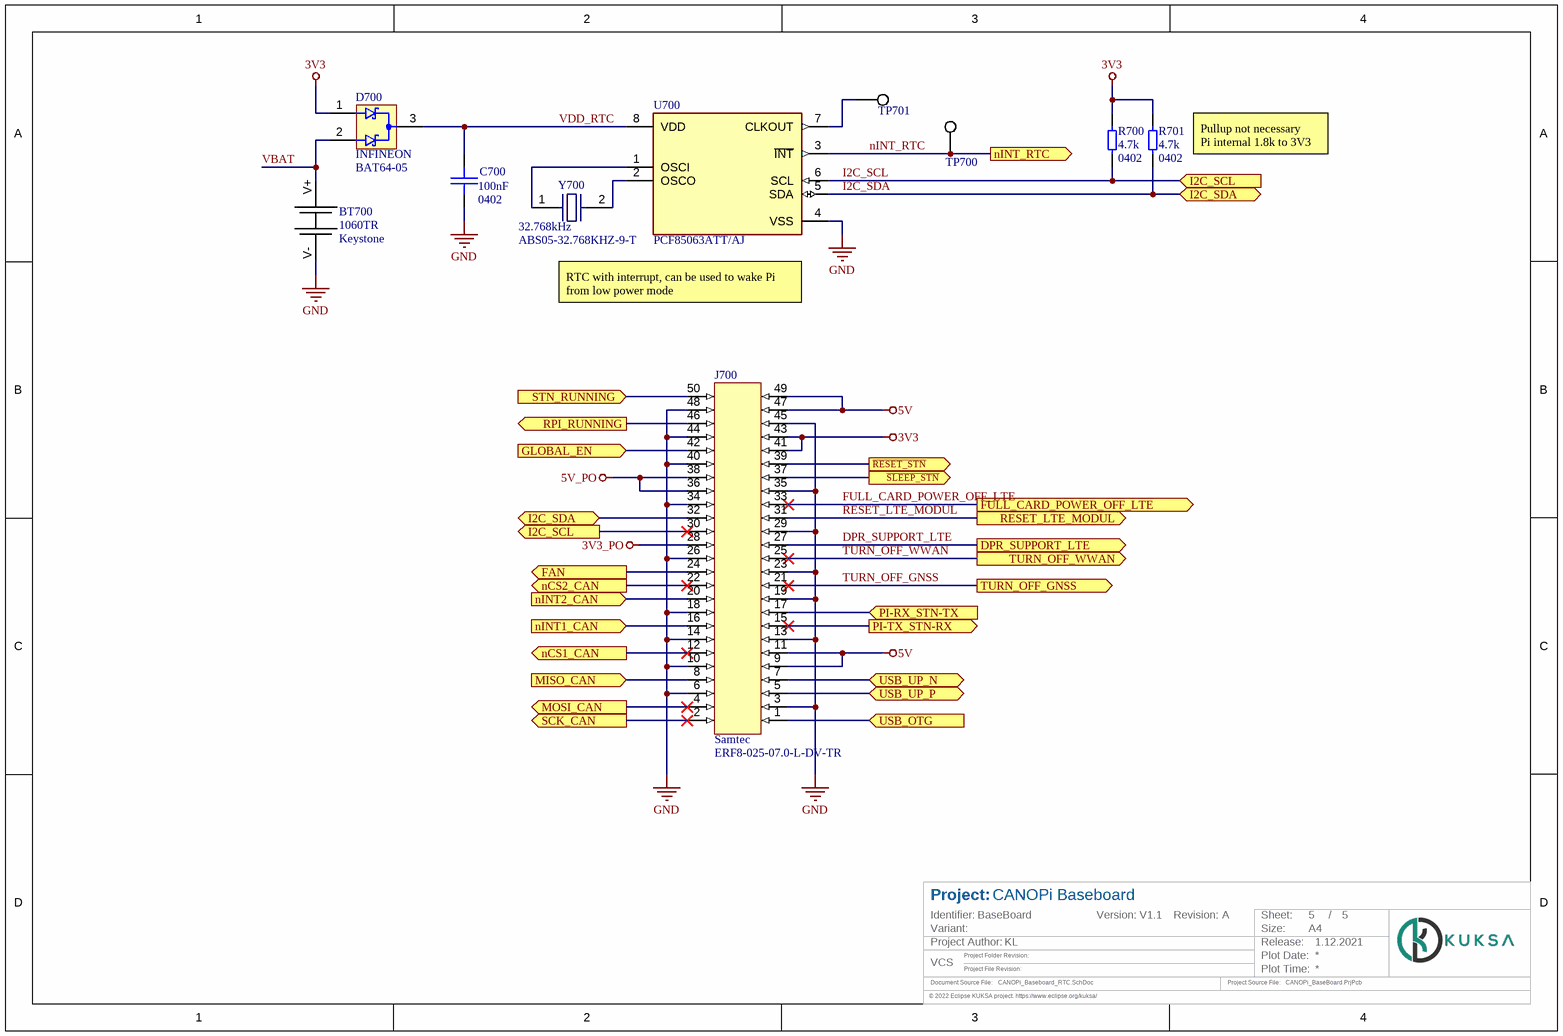
[diagram p3: CANOPi_Baseboard_RTC.SchDoc]

### Parts
BT700  Manufacturer Part Number: 1060TR  Manufacturer: Keystone  [KEYSTONE - 1060-Footprint-1]  (hidden comment: KEYSTONE - 1060)
C700  Capacitance: 100nF  Case: 0402  [CAP 0402 [1005 Metric] X050 N]  (hidden comment: CAP 0402 100n -10% +10% 6.3V X7R)
D700  Manufacturer: INFINEON  Manufacturer Part Number: BAT64-05  [INFINEON - BAT64-04]  (hidden comment: INFINEON - BAT64-05)
J700  Manufacturer: Samtec  Manufacturer Part Number: ERF8-025-07.0-L-DV-TR  [SAMTEC - ERF-025-05.0-L-DV-TR-Footprint-1]  (hidden comment: SAMTEC - ERF8-025-07.0-L-DV-TR)
R700  Resistance: 4.7k  Case: 0402  [RES 0402 [1005 Metric]_N]  (hidden comment: RES 0402 4K7 1% 0W0625)
R701  Resistance: 4.7k  Case: 0402  [RES 0402 [1005 Metric]_N]  (hidden comment: RES 0402 4K7 1% 0W0625)
TP700  Testpad, 0.8mm x 0.8mm, round  [Testpad, 0.8mm x 0.8mm, round]  (value not drawn)  (no BOM)
TP701  Testpad, 0.8mm x 0.8mm, round  [Testpad, 0.8mm x 0.8mm, round]  (value not drawn)  (no BOM)
U700  PCF85063ATT/AJ  [FP-SOT505-1-MFG]
Y700  Manufacturer Part Number: ABS05-32.768KHZ-9-T  Frequency: 32.768kHz  [ABRACON - ABS05-32.768KHZ-9-T]  (hidden comment: ABRACON - ABS05-32.768KHZ-9-T)

### Ports
DPR_SUPPORT_LTE (out), FAN (out), FULL_CARD_POWER_OFF_LTE (out), GLOBAL_EN (in), I2C_SCL (in), I2C_SCL (out), I2C_SDA (bidir), MISO_CAN (in), MOSI_CAN (out), nCS1_CAN (out), nCS2_CAN (out), nINT1_CAN (in), nINT2_CAN (in), nINT_RTC (out), PI-RX_STN-TX (in), PI-TX_STN-RX (out), RESET_LTE_MODUL (out), RPI_RUNNING (out), SCK_CAN (out), STN_RUNNING (in), TURN_OFF_GNSS (out), TURN_OFF_WWAN (out), USB_OTG (in), USB_UP_N (bidir), USB_UP_P (bidir), ~{RESET_STN} (out), ~{SLEEP_STN} (out)

### Nets
3V3: D700.1 J700.41 J700.43 R700.2 R701.2
3V3_PO: J700.28
5V: J700.9 J700.11 J700.47 J700.49
5V_PO: J700.36 J700.38
GND: BT700.V- C700.1 J700.3 J700.6 J700.10 J700.13 J700.14 J700.18 J700.19 J700.23 J700.26 J700.29 J700.34 J700.35 J700.40 J700.44 J700.45 J700.48 U700.4(VSS)
~{RESET}: J700.39 ; port ~{RESET_STN}
~{SLEEP}: J700.37 ; port ~{SLEEP_STN}
DPR_SUPPORT_LTE: J700.27 ; port DPR_SUPPORT_LTE
FAN: J700.24 ; port FAN
FULL_CARD_POWER_OFF_LTE: J700.33 ; port FULL_CARD_POWER_OFF_LTE
GLOBAL_EN: J700.42 ; port GLOBAL_EN
I2C_SCL: J700.30 R700.1 U700.6(SCL) ; port I2C_SCL
I2C_SDA: J700.32 R701.1 U700.5(SDA) ; port I2C_SDA
MISO_CAN: J700.8 ; port MISO_CAN
MOSI_CAN: J700.4 ; port MOSI_CAN
nCS1_CAN: J700.12 ; port nCS1_CAN
nCS2_CAN: J700.22 ; port nCS2_CAN
nINT1_CAN: J700.16 ; port nINT1_CAN
nINT2_CAN: J700.20 ; port nINT2_CAN
nINT_RTC: TP700.1 U700.3(~{INT}) ; port nINT_RTC
PI-RX_STN-TX: J700.17 ; port PI-RX_STN-TX
PI-TX_STN-RX: J700.15 ; port PI-TX_STN-RX
RESET_LTE_MODUL: J700.31 ; port RESET_LTE_MODUL
RPI_RUNNING: J700.46 ; port RPI_RUNNING
SCK_CAN: J700.2 ; port SCK_CAN
STN_RUNNING: J700.50 ; port STN_RUNNING
TURN_OFF_GNSS: J700.21 ; port TURN_OFF_GNSS
TURN_OFF_WWAN: J700.25 ; port TURN_OFF_WWAN
USB_OTG: J700.1 ; port USB_OTG
USB_UP_N: J700.7 ; port USB_UP_N
USB_UP_P: J700.5 ; port USB_UP_P
VBAT: BT700.V+ D700.2
VDD_RTC: C700.2 D700.3 U700.8(VDD)
NetTP701_1: TP701.1 U700.7(CLKOUT)
NetU700_1: U700.1(OSCI) Y700.1
NetU700_2: U700.2(OSCO) Y700.2

### Notes on the sheet
- (near R701) Pullup not necessary
  Pi internal 1.8k to 3V3
- RTC with interrupt, can be used to wake Pi from low power mode
- Project:
- Identifier:
- Version:
- Revision:
- Sheet:
- /
- VCS
- Variant:
- Document Source File:
- Project Author:
- Project Folder Revision:
- Project File Revision:
- Project Source File:
- Plot Date:
- Size:
- Plot Time:
- Release:
- A4
- © 2022 Eclipse KUKSA project. https://www.eclipse.org/kuksa/
- Drawn by:
- © Robert Bosch GmbH         . All rights reserved, also regarding any disposal, exploitation, reproduction, editing, distribution, as well as in the event of applications for industrial property rights.

### Library data of the parts
BT700 = CMP-11274-2: Batterie Halter (offen) Kreisförmige Scheibe, 20,0mm 1 Zellen SMD (SMT) Tab; Assembly: yes; Battery Sizes Accepted: CR2032; No. of Batteries: 1; Operating Temperature min: -50°C; ComponentLink1URL: https://www.keyelco.com/product.cfm/product_id/726; Case: Coin; ComponentLink1Description: Manufacturer Link; Operating Temperature max: 146°C; Mounting Type: SMT
C700 = CMP-04212-4: as C606 on sheet CANOPi_Baseboard_PWR; Operating Temperature min: -55°C; Voltage Rating: 6.3V; Operating Temperature max: 125°C; ComponentLink1URL: http://psearch.en.murata.com/capacitor/lineup/grm/; IPC Footprint Naming: CAPC1005X050; Capacitance Tolerance neg: -10%; ComponentLink1Description: Datasheet; Dielectric Type: X7R; Mounting Type: SMT
D700 = CMP-07595-3: Dual Silicon Schottky Diodes; Assembly: yes; Forward Current: 250mA; Forward Voltage: 750mV; Reverse Voltage: 40V; Case: SOT-23; ComponentLink1Description: Datasheet; ComponentLink1URL: https://www.infineon.com/dgdl/Infineon-BAT64SERIES-DataSheet-v01_00-EN.pdf?fileId=5546d4626d66c2b1016d73f85ab420ed; Mounting Type: SMT; Operating Temperature max: 150°C; Operating Temperature min: -55°C
J700 = CMP-11271-4: 50 Poliger Steckverbinder Sockel, äußere Abdeckungskontakte Oberflächenmontage Gold; Current Rating: 1,1A; Voltage Rating: 200V; Gender: Female; Pitch Spacing: 800µm; Assembly: yes; System: Connector; ComponentLink1URL: https://www.samtec.com/de/products/erf8-025-07.0-l-dv-k-tr; ComponentLink1Description: Manufacturer Link; Operating Temperature max: 150°C; Operating Temperature min: -40°C; Number of Rows: 2; Mounting Type: SMT; Number of Pins: 50
R700 R701 = CMP-00920-7: RC0402 series chip resistor with lead-free terminations made by thick film process; Manufacturer Part Number: RC0402FR-074K7L; Manufacturer: YAGEO; Value: 4.7k; Power Rating: 62.5mW; Assembly: yes; Voltage Rating: 50V; Current Rating: 1A; Temperature Coefficient: ±100ppm/K; ComponentLink1URL: https://www.yageo.com/upload/media/product/productsearch/datasheet/rchip/PYu-RC_Group_51_RoHS_L_10.pdf; Operating Temperature max: 155°C; IPC Footprint Naming: RESC1005X04; Resistor Element Type: Thick Film; Mounting Type: SMT; Operating Temperature min: -55°C; ComponentLink1Description: Datasheet; Resistance Tolerance: 1%
TP700 TP701 = CMP-00390-13: Assembly: no; Case: 0.8x0.8mm, round
U700 = CMP-10083-000008-1: IC RTC CLK/CALENDAR I2C 8TSSOP; Manufacturer: NXP Semiconductors; Min Supply Voltage: 0.9V; Max Supply Voltage: 5.5V; Nominal Supply Current: 0.22-18uA; Number Of Outputs: 1; Standoff Height: 0.05mm; Frequency: 32.768kHz; Temperature Range Low: -40°C; Height: 1.1mm; Digikey Description: IC RTC CLK/CALENDAR I2C 8TSSOP; Device Class L2: Clock and Timing; Ambient Temperature Range High: +85°C; ComponentLink2URL: https://www.nxp.com/docs/en/data-sheet/PCF85063A.pdf; Category: IC; Temperature: -40°C to +85°C; RoHS: TRUE; Ambient Temperature Range Low: -40°C; Footprint Url: https://www.nxp.com/docs/en/package-information/SOT505-1.pdf; Octopart: https://octopart.com/pcf85063att%2Faj-nxp+semiconductors-46729225; Temperature Range High: +85°C; Device Class L3: Real Time Clocks; Automotive: No; Package: SOT505-1; Manufacturer Part Number: PCF85063ATT/AJ; Device Class L1: Integrated Circuits (ICs); Interface: I2C; Lead Free: Yes; ComponentLink2Description: Datasheet; Mouser Description: Real Time Clock Serial Clock/Calendar/Alarm/Timer/Interrupt 8-Pin TSSOP T/R
Y700 = CMP-00465-3: Crystals 32.768KHz 9.0pF 20ppm -40C +85C; Load Capacitance (CL): 12.5pF; Assembly: yes; Frequency Stability: 0; Manufacturer: ABRACON; Frequency Tolerance: 20ppm; Operating Temperature max: 85°C; Mounting Type: SMT; Operating Temperature min: -40°C; Case: 2-SMD (1.60mm x 1.00mm); ComponentLink1Description: Datasheet; ComponentLink1URL: http://www.mouser.com/ds/2/3/ABS05-25797.pdf